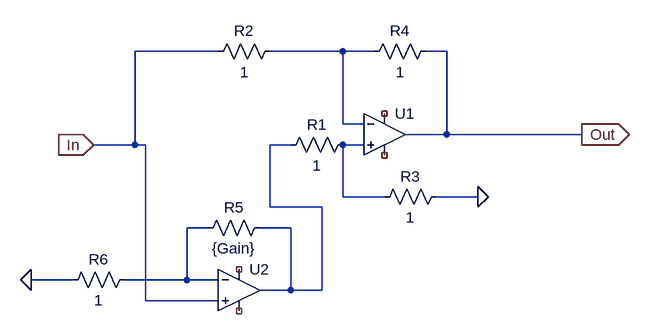
[diagram p0: schematic noninvertingOpAmp_vfvi.asc]
noninvertingOpAmp_vfvi.asc, the LTspice schematic file:
Version 4.1
SHEET 1 880 680
WIRE -64 -64 -192 -64
WIRE 128 -64 16 -64
WIRE 176 -64 128 -64
WIRE 288 -64 256 -64
WIRE 128 48 128 -64
WIRE 160 48 128 48
WIRE 288 64 288 -64
WIRE 288 64 224 64
WIRE 496 64 288 64
WIRE -192 80 -192 -64
WIRE -192 80 -256 80
WIRE -176 80 -192 80
WIRE 48 80 16 80
WIRE 160 80 128 80
WIRE 128 160 128 80
WIRE 192 160 128 160
WIRE 336 160 272 160
WIRE 16 176 16 80
WIRE 96 176 16 176
WIRE -80 208 -112 208
WIRE 48 208 0 208
WIRE -288 288 -352 288
WIRE -112 288 -112 208
WIRE -112 288 -208 288
WIRE -64 288 -112 288
WIRE 48 304 48 208
WIRE 48 304 0 304
WIRE 96 304 96 176
WIRE 96 304 48 304
WIRE -176 320 -176 80
WIRE -64 320 -176 320
FLAG 336 160 0
FLAG 496 64 Out
IOPIN 496 64 Out
FLAG -256 80 In
IOPIN -256 80 In
FLAG -352 288 0
SYMBOL OpAmps\\UniversalOpAmp 192 64 R0
SYMATTR InstName U1
SYMBOL res 144 64 R90
WINDOW 0 0 56 VBottom 2
WINDOW 3 32 56 VTop 2
SYMATTR InstName R1
SYMATTR Value 1
SYMBOL res -80 -48 R270
WINDOW 0 32 56 VTop 2
WINDOW 3 0 56 VBottom 2
SYMATTR InstName R2
SYMATTR Value 1
SYMBOL res 288 144 R90
WINDOW 0 0 56 VBottom 2
WINDOW 3 32 56 VTop 2
SYMATTR InstName R3
SYMATTR Value 1
SYMBOL res 272 -80 R90
WINDOW 0 0 56 VBottom 2
WINDOW 3 32 56 VTop 2
SYMATTR InstName R4
SYMATTR Value 1
SYMBOL res 16 192 R90
WINDOW 0 0 56 VBottom 2
WINDOW 3 32 56 VTop 2
SYMATTR InstName R5
SYMATTR Value {Gain}
SYMBOL res -192 272 R90
WINDOW 0 0 56 VBottom 2
WINDOW 3 32 56 VTop 2
SYMATTR InstName R6
SYMATTR Value 1
SYMBOL OpAmps\\UniversalOpAmp -32 304 R0
SYMATTR InstName U2

The netlist it stands for:
* noninvertingOpAmp_vfvi.asc
X§U1 N003 N001 NC_01 NC_02 Out level1 Avol=1Meg GBW=10Meg Vos=0 En=0 Enk=0 In=0 Ink=0 Rin=500Meg  ; pins In+ In- V+ V- OUT
R1 N003 N002 1
R2 In N001 1
R3 0 N003 1
R4 Out N001 1
R5 N002 N004 {Gain}
R6 N004 0 1
X§U2 In N004 NC_03 NC_04 N002 level1 Avol=1Meg GBW=10Meg Vos=0 En=0 Enk=0 In=0 Ink=0 Rin=500Meg  ; pins In+ In- V+ V- OUT
.lib UniversalOpAmp1.lib
.backanno
.end